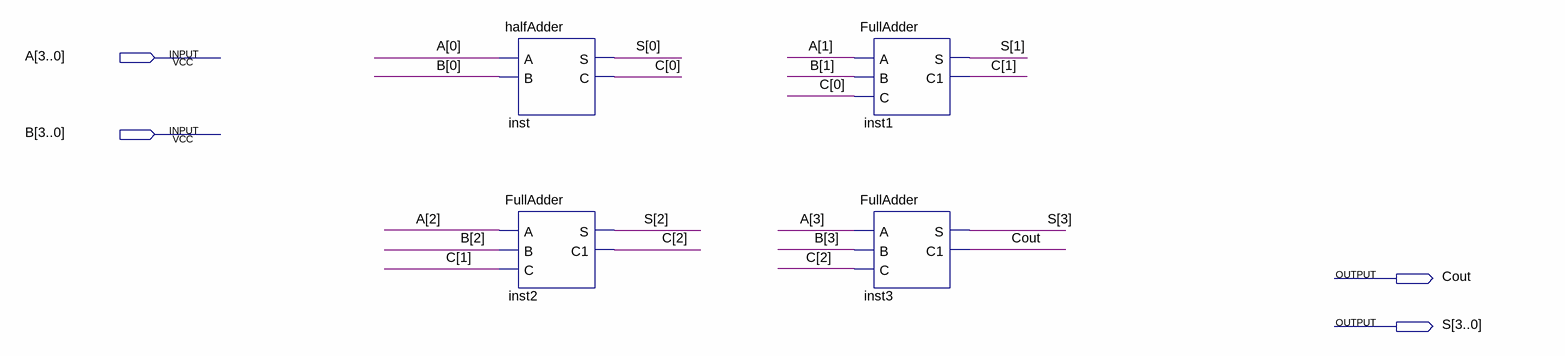
[diagram p0: schematic sheet]
// Quartus schematic binAdder.bdf as structural Verilog: 4 symbols, 4 pins
module binAdder (
  input  [3:0] A,
  input  [3:0] B,
  output Cout,
  output [3:0] S
);

  wire [2:0] C;

  halfAdder inst (.A(A[0]), .B(B[0]), .S(S[0]), .C(C[0]));
  FullAdder inst2 (.A(A[2]), .B(B[2]), .C(C[1]), .S(S[2]), .C1(C[2]));
  FullAdder inst1 (.A(A[1]), .B(B[1]), .C(C[0]), .S(S[1]), .C1(C[1]));
  FullAdder inst3 (.A(A[3]), .B(B[3]), .C(C[2]), .S(S[3]), .C1(Cout));
endmodule
